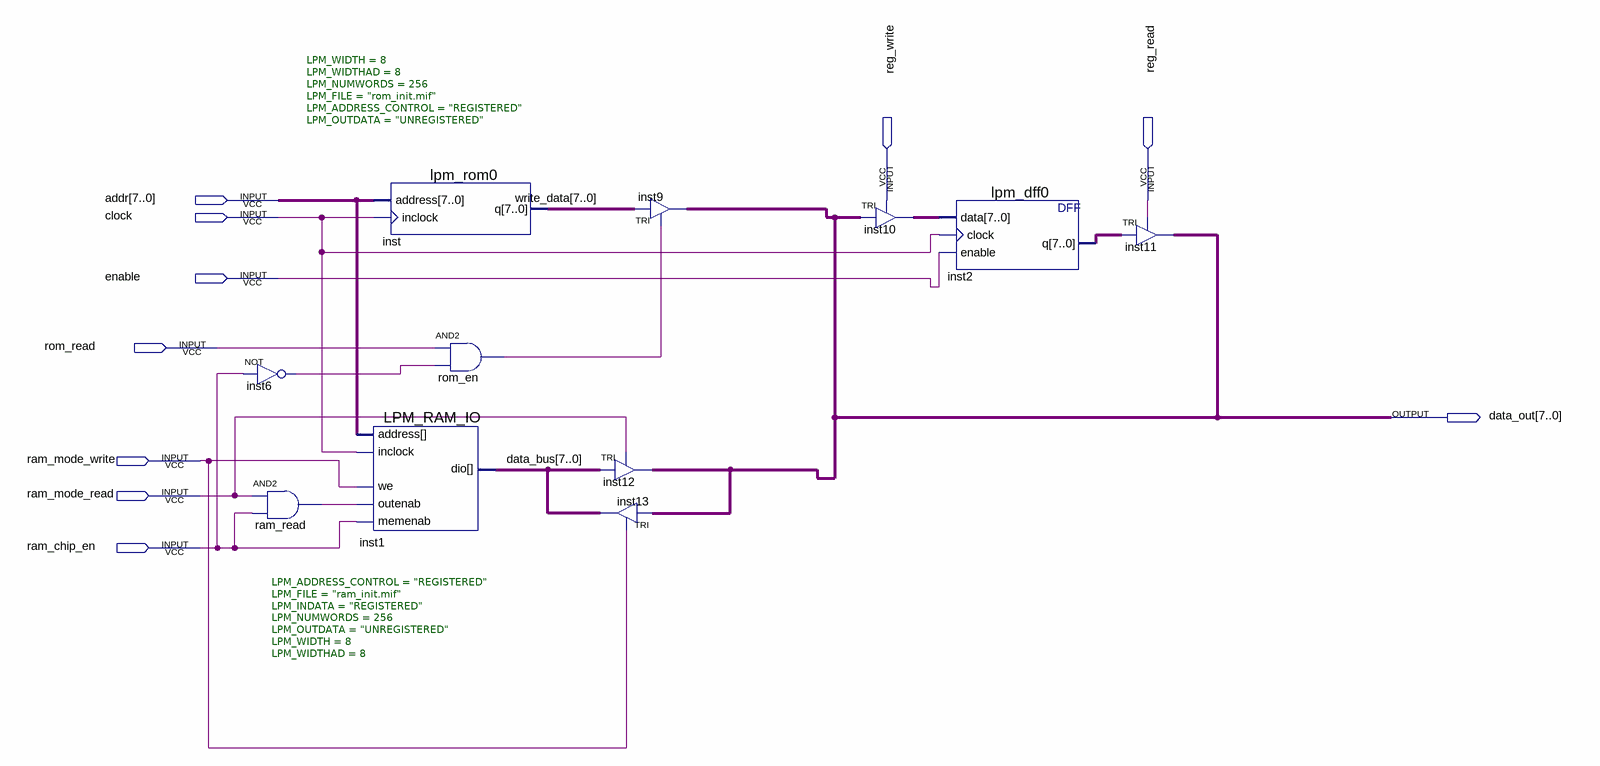
[diagram p0: schematic sheet]
// Quartus schematic lab_3_2.bdf as structural Verilog: 11 symbols, 10 pins
module lab_3_2 (
  input  [7:0] addr,
  input  reg_write,
  input  reg_read,
  input  clock,
  input  enable,
  input  rom_read,
  input  ram_mode_write,
  input  ram_mode_read,
  input  ram_chip_en,
  output [7:0] data_out
);

  wire inst6_out, ram_read_out, rom_en_out;
  wire [7:0] data_bus, inst2_q, inst10_out, write_data;

  not inst6 (inst6_out, ram_chip_en);
  and ram_read (ram_read_out, ram_mode_read, ram_chip_en);
  lpm_rom0 #(.LPM_WIDTH(8), .LPM_WIDTHAD(8), .LPM_NUMWORDS(256), .LPM_FILE("rom_init.mif"), .LPM_ADDRESS_CONTROL("REGISTERED"), .LPM_OUTDATA("UNREGISTERED")) inst (
    .address(addr), .inclock(clock), .q(write_data));
  LPM_RAM_IO #(.LPM_ADDRESS_CONTROL("REGISTERED"), .LPM_FILE("ram_init.mif"), .LPM_INDATA("REGISTERED"), .LPM_NUMWORDS(256), .LPM_OUTDATA("UNREGISTERED"), .LPM_WIDTH(8), .LPM_WIDTHAD(8)) inst1 (
    .address(addr), .memenab(ram_chip_en), .inclock(clock), .we(ram_mode_write), .outenab(ram_read_out),
    .dio(data_bus));
  and rom_en (rom_en_out, rom_read, inst6_out);
  TRI inst9[7:0] (.IN(write_data), .OE(rom_en_out), .OUT(data_out));
  TRI inst12[7:0] (.IN(data_bus), .OE(ram_mode_read), .OUT(data_out));
  TRI inst13[7:0] (.IN(data_out), .OE(ram_mode_write), .OUT(data_bus));
  TRI inst10[7:0] (.IN(data_out), .OE(reg_write), .OUT(inst10_out));
  lpm_dff0 inst2 (.data(inst10_out), .clock(clock), .enable(enable), .q(inst2_q));
  TRI inst11[7:0] (.IN(inst2_q), .OE(reg_read), .OUT(data_out));
endmodule
